# EAGLE design arcade_old (EAGLE 9.6.2)
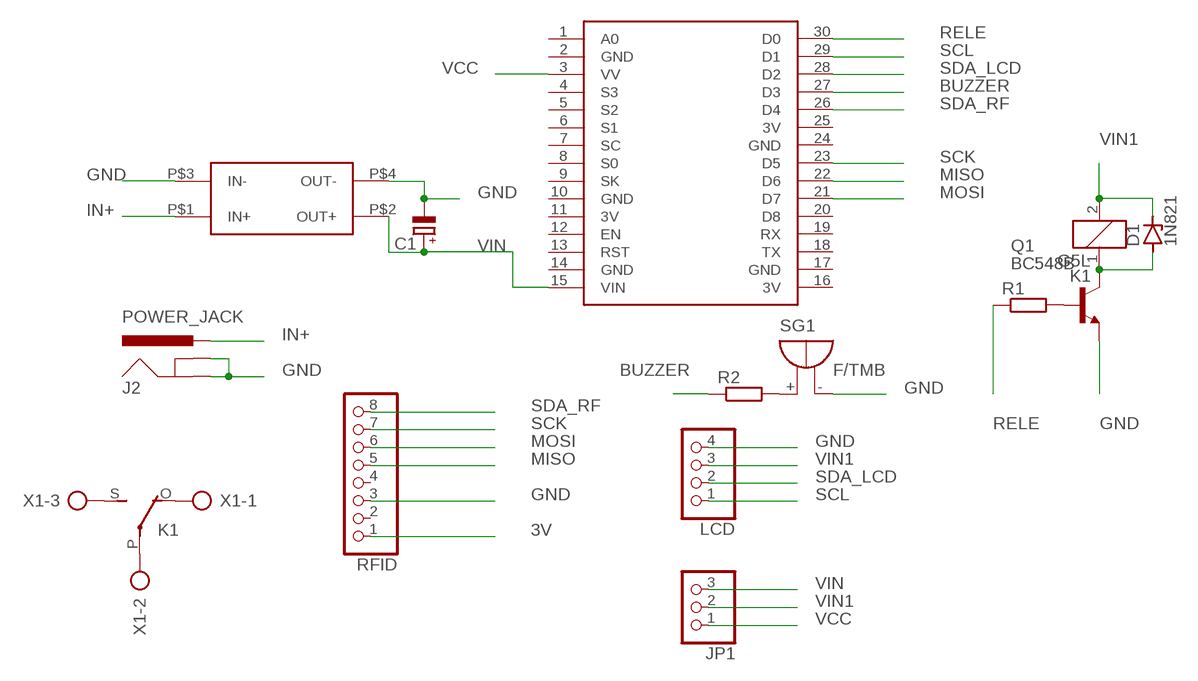
[diagram p0: schematic, sheet 1]

## Parts
C1  CPOL-EUE2,5-6E  [E2,5-6E]
D1  1N821  [DO35Z10]
J2  POWER_JACK  [POWER_JACK_PTH]
JP1  PINHD-1X3  [1X03]
K1  G5L  [G5LE]
LCD  PINHD-1X4  [1X04]
Q1  BC548B  [TO92-EBC]
R1  R-EU_0204/5  [0204/5]
R2  R-EU_0204/5  [0204/5]
RFID  PINHD-1X8  [1X08]
SG1  F/TMB  [F/TMB]
U$1  NODEMCU  [NODEMCU]
U$2  LM2596  [LM2596]
X1  AK300/3  [AK300/3]

## Nets
3V: RFID.1
BUZZER: R2.1 U$1.27(D3)
GND: C1.- J2.GND J2.GNDBREAK LCD.4 Q1.E RFID.3 SG1.- U$2.P$3(IN-) U$2.P$4(OUT-)
IN+: J2.PWR U$2.P$1(IN+)
MISO: RFID.5 U$1.22(D6)
MOSI: RFID.6 U$1.21(D7)
N$1: K1.P(2:P) X1.2
N$2: K1.S(2:S) X1.3
N$3: K1.O(2:O) X1.1
N$4: Q1.B R1.2
N$5: D1.A K1.1 Q1.C
N$6: R2.2 SG1.+
RELE: R1.1 U$1.30(D0)
SCK: RFID.7 U$1.23(D5)
SCL: LCD.1 U$1.29(D1)
SDA_LCD: LCD.2 U$1.28(D2)
SDA_RF: RFID.8 U$1.26(D4)
VCC: JP1.1 U$1.3(VV)
VIN: C1.+ JP1.3 U$1.15(VIN) U$2.P$2(OUT+)
VIN1: D1.C JP1.2 K1.2 LCD.3
Unconnected: RFID.2 RFID.4 U$1.1(A0) U$1.4(S3) U$1.5(S2) U$1.6(S1) U$1.7(SC) U$1.8(S0) U$1.9(SK) U$1.12(EN) U$1.13(RST) U$1.18(TX) U$1.19(RX) U$1.20(D8)

## Power pins joined to a net without a drawn wire
3V: U$1.11(3V) U$1.16(3V) U$1.25(3V)
GND: U$1.2(GND) U$1.10(GND) U$1.14(GND) U$1.17(GND) U$1.24(GND)

## Library data of the parts
C1 = rcl:CPOL-EU: POLARIZED CAPACITOR, European symbol; SPICEPREFIX: C
D1 = diode:1N821: Reference DIODE temperature compensated, 6,2 V
J2 = SparkFun-Connectors:POWER_JACK: Power Jack Connector This is the standard 5.5mm barrel jack for power. The PTH is the most common, proven, reliable, footprint. The Slot footprint only works if the mill layer is transmitted to the PCB fab house so be warned. Here are the connectors we sell at SparkFun: DC Barrel Power Jack/Connector <https://www.sparkfun.com/products/119> (PRT-00119) DC Barrel Power Jack/Connector (SMD) <https://www.sparkfun.com/products/12748> (PRT-12748) DC Barrel Jack Adapter - Breadboard Compatible <https://www.sparkfun.com/products/10811> (PRT-10811) It is used on this SparkFun product (and many, many others): SparkFun RedBoard - Programmed with Arduino <https://www.sparkfun.com/products/12757> (DEV-12757) Also, if you need a mating power supply or connector, please check these out: Wall Adapter Power Supply - 9VDC 650mA <https://www.sparkfun.com/products/298> (TOL-00298) DC Barrel Jack Adapter - Male <https://www.sparkfun.com/products/10287> (PRT-10287); PROD_ID: CONN-08197
JP1 = pinhead:PINHD-1X3: PIN HEADER
K1 = relay:G5L: RELAY 1 x switch, 10 A/120 V AC, 8 A/30 V ADC, Omron; OC_FARNELL: unknown; OC_NEWARK: unknown
LCD = pinhead:PINHD-1X4: PIN HEADER
Q1 = transistor-npn:BC548*: NPN Transistor
R1 R2 = rcl:R-EU_: RESISTOR, European symbol; SPICEPREFIX: R
RFID = pinhead:PINHD-1X8: PIN HEADER
SG1 = buzzer:F/TMB: BUZZER Source: Buerklin; OC_FARNELL: unknown; OC_NEWARK: unknown
U$1 = nodemcu:NODEMCU
U$2 = LM2596:LM2596
X1 = con-ptr500:AK300/3: CONNECTOR; OC_FARNELL: unknown; OC_NEWARK: unknown

## Board
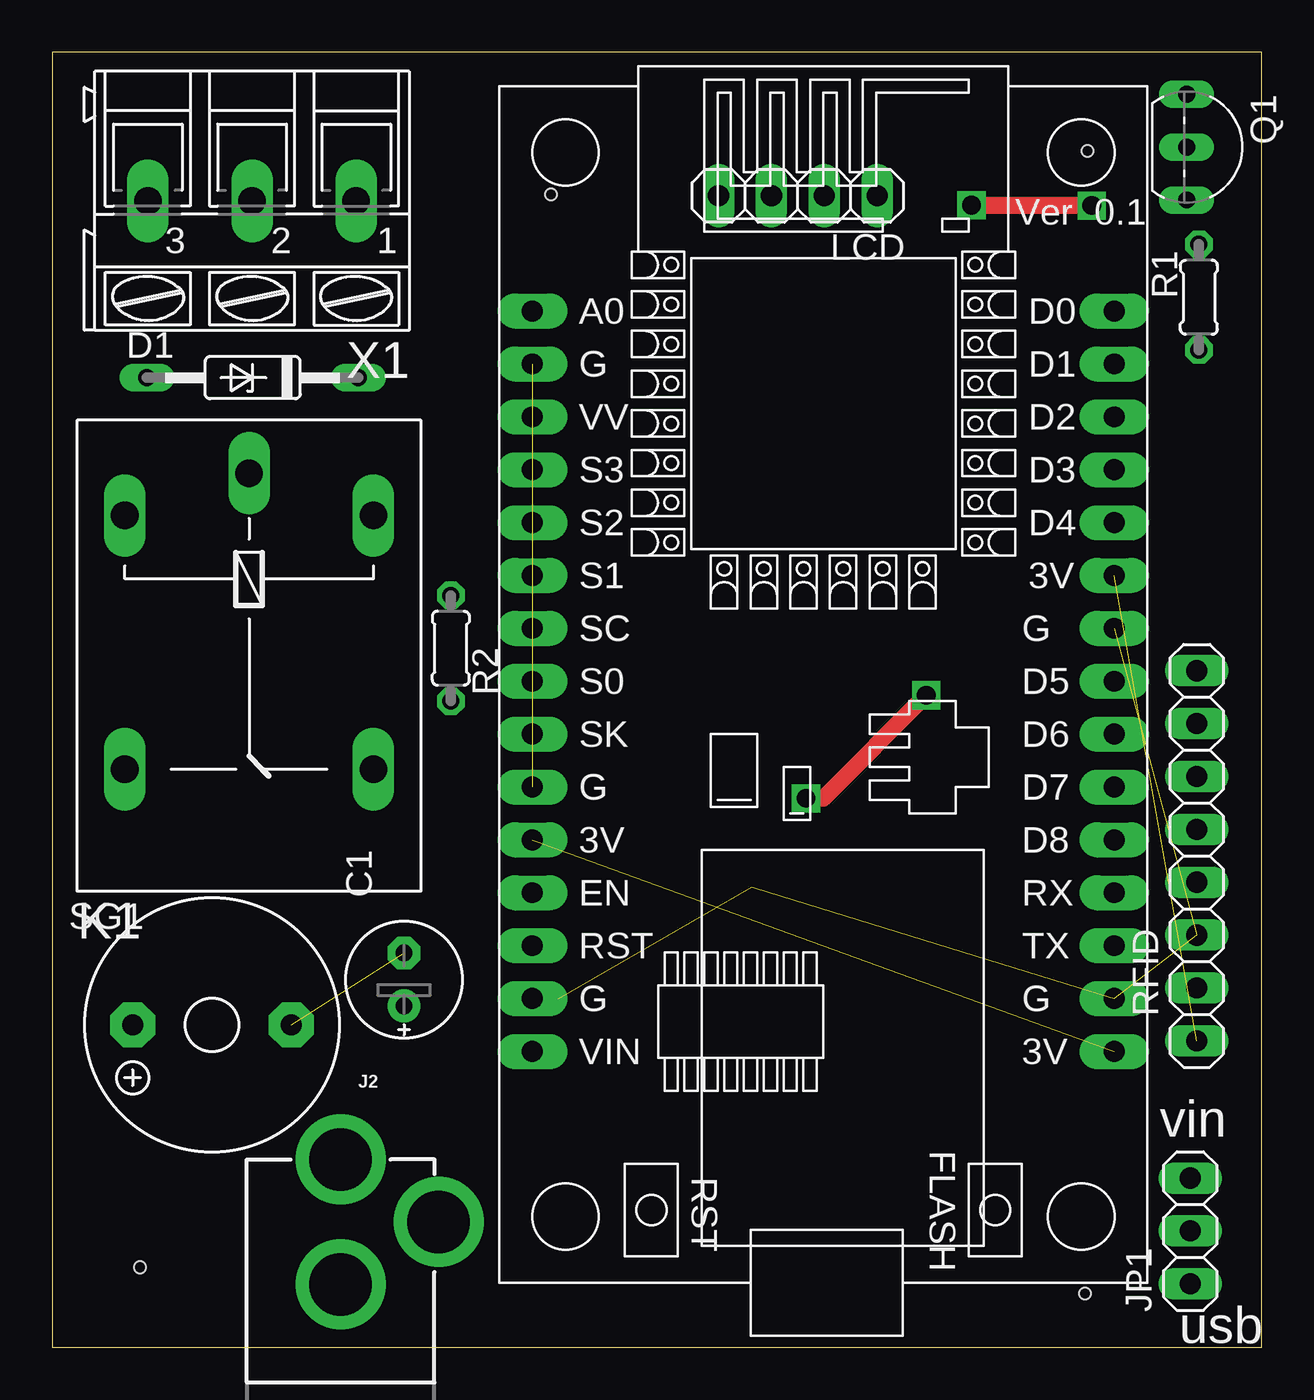
[diagram p1: board, top side]
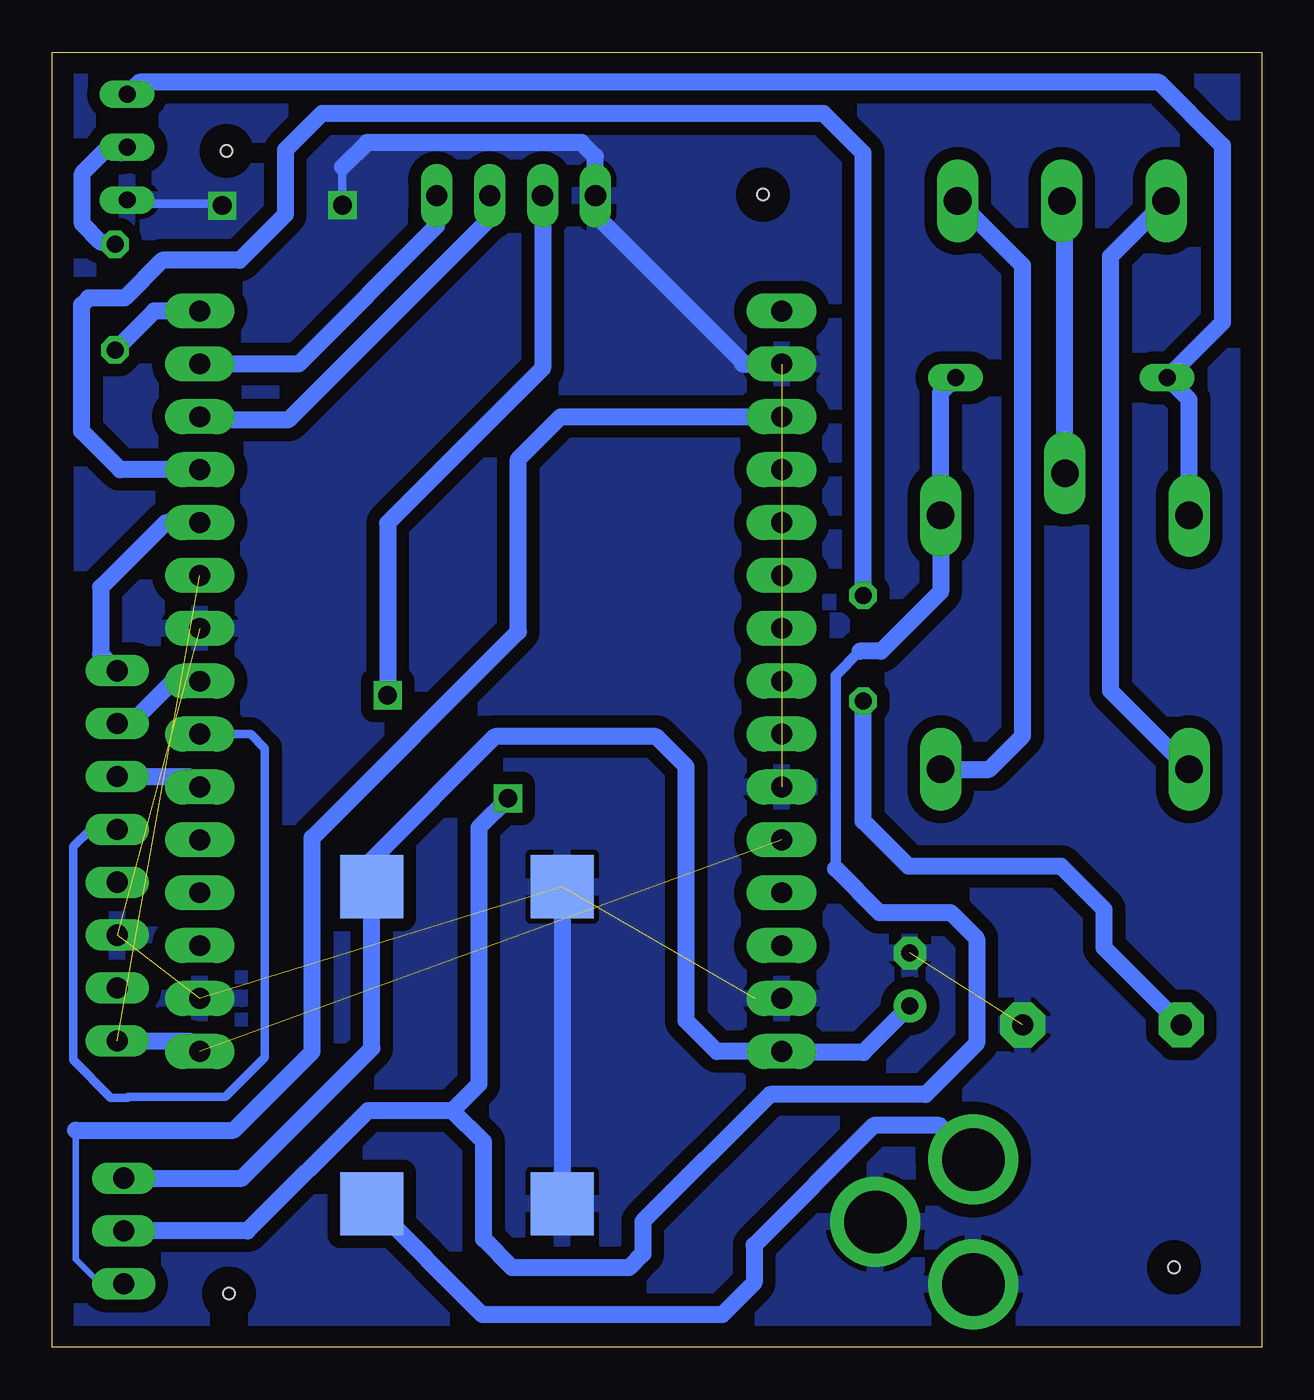
[diagram p2: board, bottom side, seen from below]

Size 58.09 x 62.22 mm. Coordinates in mm from the lower left corner, seen from the top.
Outline: 0,0 58.09,0 58.09,62.22 0,62.22 0,0
Copper layers (1*16): Top 0.035mm / dielectric 1.5mm / Bottom 0.035mm
Design rules "default": minimum track width 6mil, minimum drill 0.35mm, track to track 6mil, track to pad 6mil, pad to pad 6mil, via to via 6mil, smd to smd 6mil, copper to edge 40mil, drill to drill 6mil, minimum pad ring 10mil, minimum via ring 8mil, stop-mask expansion 4mil, vias tented up to drill 0mil, thermal gap 10mil
Holes 0.55 mm at 4.22,3.85 49.6,2.59 49.72,57.47 23.95,55.37

### Footprints (pad centres in the part's own frame; a part is rotated, then mirrored left to right if it is on the bottom)
E2,5-6E = drill 0.813 pad 1.575: + -1.27,0 | drill 0.813 pad 1.575 octagon: - 1.27,0
DO35Z10 = drill 0.813 long: A 5.08,0; C -5.08,0
POWER_JACK_PTH = drill 2.997 pad 4.318: GND 0,7.7; GNDBREAK 4.7,10.7; PWR 0,13.7
1X03 = drill 1.016 long: 1 -2.54,0; 2 0,0; 3 2.54,0
G5LE = drill 1.321 long: 1 -7.493,-5.969; 2 -7.493,5.969; O 4.699,5.969; P -9.525,0; S 4.699,-5.969
1X04 = drill 1.016 long: 1 -3.81,0; 2 -1.27,0; 3 1.27,0; 4 3.81,0
TO92-EBC = drill 0.813 long: B 0,-1.27; C -2.54,-1.27; E 2.54,-1.27
0204/5 = drill 0.813 octagon: 1 -2.54,0; 2 2.54,0
1X08 = drill 1.016 long: 1 -8.89,0; 2 -6.35,0; 3 -3.81,0; 4 -1.27,0; 5 1.27,0; 6 3.81,0; 7 6.35,0; 8 8.89,0
F/TMB = drill 1.016 pad 2.159 octagon: + 3.81,0; - -3.81,0
NODEMCU = drill 1 pad 1.676 long: 1 -13.97,17.78; 2 -13.97,15.24; 3 -13.97,12.7; 4 -13.97,10.16; 5 -13.97,7.62; 6 -13.97,5.08; 7 -13.97,2.54; 8 -13.97,0; 9 -13.97,-2.54; 10 -13.97,-5.08; 11 -13.97,-7.62; 12 -13.97,-10.16; 13 -13.97,-12.7; 14 -13.97,-15.24; 15 -13.97,-17.78; 16 13.97,-17.78; 17 13.97,-15.24; 18 13.97,-12.7; 19 13.97,-10.16; 20 13.97,-7.62; 21 13.97,-5.08; 22 13.97,-2.54; 23 13.97,0; 24 13.97,2.54; 25 13.97,5.08; 26 13.97,7.62; 27 13.97,10.16; 28 13.97,12.7; 29 13.97,15.24; 30 13.97,17.78
LM2596 = smd 3.032 x 3.032 bottom: P$1 0,0; P$2 15.24,0; P$3 0,9.144; P$4 15.24,9.144
AK300/3 = drill 1.321 long: 1 -5.004,0; 2 0,0; 3 5.004,0

### Placement (x,y rotation side)
C1  16.9,17.67 90 top
D1  9.63,46.58 180 top
J2  13.86,-4.67 0 top
JP1  54.64,5.59 90 top
K1  9.46,32.47 270 top
LCD  35.81,55.32 180 top
Q1  55.75,57.66 270 top
R1  55.07,50.44 90 top
R2  19.14,33.58 270 top
RFID  54.96,23.61 90 top
SG1  7.68,15.49 180 top
U$1  37.03,32 0 top
U$2  42.74,6.89 90 top
X1  9.6,55.08 180 top

### Tracks (layer width: path | path; a pad name or v marks a point on that pad's centre or on a via)
3V  (2 unrouted)
  Bottom 0.813: RFID.1 51.51,14.72 U$1.16
BUZZER
  Bottom 0.813: U$1.27 54.82,42.16 56.67,44.01 56.67,50.07 56.34,50.41 54.6,50.41 52.79,52.22 49.09,52.22 46.89,54.41 46.89,57.51 45.14,59.27 21.05,59.27 19.14,57.36 R2.1
GND  (via drill 0.9)  (6 unrouted)
  Top 0.813: v49.92,54.85 45.92,54.85 45.91,54.86 v44.15,54.86
  Bottom 0.406: 44.15,56.7 v44.15,54.86 | v49.92,54.85 50.01,54.95 54.31,54.95 Q1.E
  Bottom 0.813: U$1.2 24.93,47.24 24.93,47.34 32,54.41 LCD.4 32,57.2 32.68,57.88 42.97,57.88 44.15,56.7 | 24.29,16.74 23.84,16.74 23.82,16.76 U$1.14 | U$2.P$4 U$2.P$3
  pour Bottom (isolate 0.61): 0,62.23 58.6,62.23 58.6,0 0,0
IN+
  Bottom 0.813: J2.PWR 15.49,10.66 18.63,10.66 24.38,4.91 24.38,3.12 25.91,1.58 37.43,1.58 U$2.P$1
MISO
  Bottom 0.406: 50.99,29.47 U$1.22 48.56,29.46 47.88,28.78 47.88,13.94 49.78,12.03 54.43,12.03 54.45,12 55.26,12 57.07,13.81 57.07,24.06 56.24,24.88 RFID.5
MOSI
  Bottom 0.813: RFID.6 51.51,27.42 U$1.21
N$1
  Bottom 0.813: K1.P 9.46,54.93 X1.2
N$2
  Bottom 0.813: K1.S 7.26,31.54 7.26,52.41 X1.3
N$3
  Bottom 0.813: K1.O 13.1,27.77 11.49,29.38 11.49,51.96 X1.1
N$4
  Bottom 0.813: 54.77,57.36 Q1.B 55.38,57.66 56.64,56.4 56.64,53.97 55.77,53.1 55.18,53.1 R1.2
N$5
  Bottom 0.813: K1.1 3.49,45.52 D1.A 1.89,49.23 1.89,57.73 4.94,60.77 53.91,60.77 Q1.C
N$6
  Bottom 0.813: 3.61,15.24 SG1.+ | SG1.+ 3.87,15.24 | SG1.+ 7.58,19.2 7.58,21.04 9.65,23.11 16.96,23.11 19.14,25.29 R2.2
RELE
  Bottom 0.813: R1.1 53.19,49.78 U$1.30
SCK
  Bottom 0.813: RFID.7 54.31,29.96 52.28,32 U$1.23
SCL
  Bottom 0.813: LCD.1 39.62,53.87 46.25,47.24 U$1.29
SDA_LCD
  Bottom 0.813: LCD.2 37.08,54.22 46.76,44.54 50.84,44.54 U$1.28
SDA_RF
  Bottom 0.813: U$1.26 52.64,39.62 55.76,36.5 55.76,33.3 RFID.8
VCC
  Bottom 0.305: JP1.1 55.78,3.06 56.95,4.23 56.95,10.44
  Bottom 0.813: 56.95,10.44 49.37,10.44 45.6,14.21 45.6,24.48 35.7,34.38 35.7,42.66 33.66,44.7 U$1.3
VIN
  Bottom 0.813: C1.+ 19.14,14.16 23,14.16 U$1.15 26.18,14.22 27.65,15.7 27.65,27.91 29.08,29.34 36.83,29.34 42.74,23.43 U$2.P$2 42.74,14.37 48.97,8.13 JP1.3
VIN1  (via drill 0.9)
  Top 0.813: v41.98,31.33 37.03,26.38 v36.2,26.38
  Bottom 0.508: 19.31,33.44 20.47,32.28 20.47,23
  Bottom 0.813: D1.C 15.43,45.86 K1.2 15.43,36.3 18.29,33.44 19.31,33.44 | 20.47,23 18.37,20.89 14.95,20.89 13.69,19.64 13.69,14.61 16.15,12.15 23.61,12.15 29.72,6.05 29.72,4.49 30.38,3.83 36,3.83 37.37,5.21 37.37,9.88 38.87,11.37 | JP1.2 48.71,5.59 42.93,11.37 38.87,11.37 | v36.2,26.38 37.6,24.97 37.6,12.64 38.87,11.37 | LCD.3 34.54,47.03 41.98,39.59 v41.98,31.33

### Text on the board
tPlace: vin | usb